# EAGLE design stokes_polarimeter (EAGLE 9.6.2)
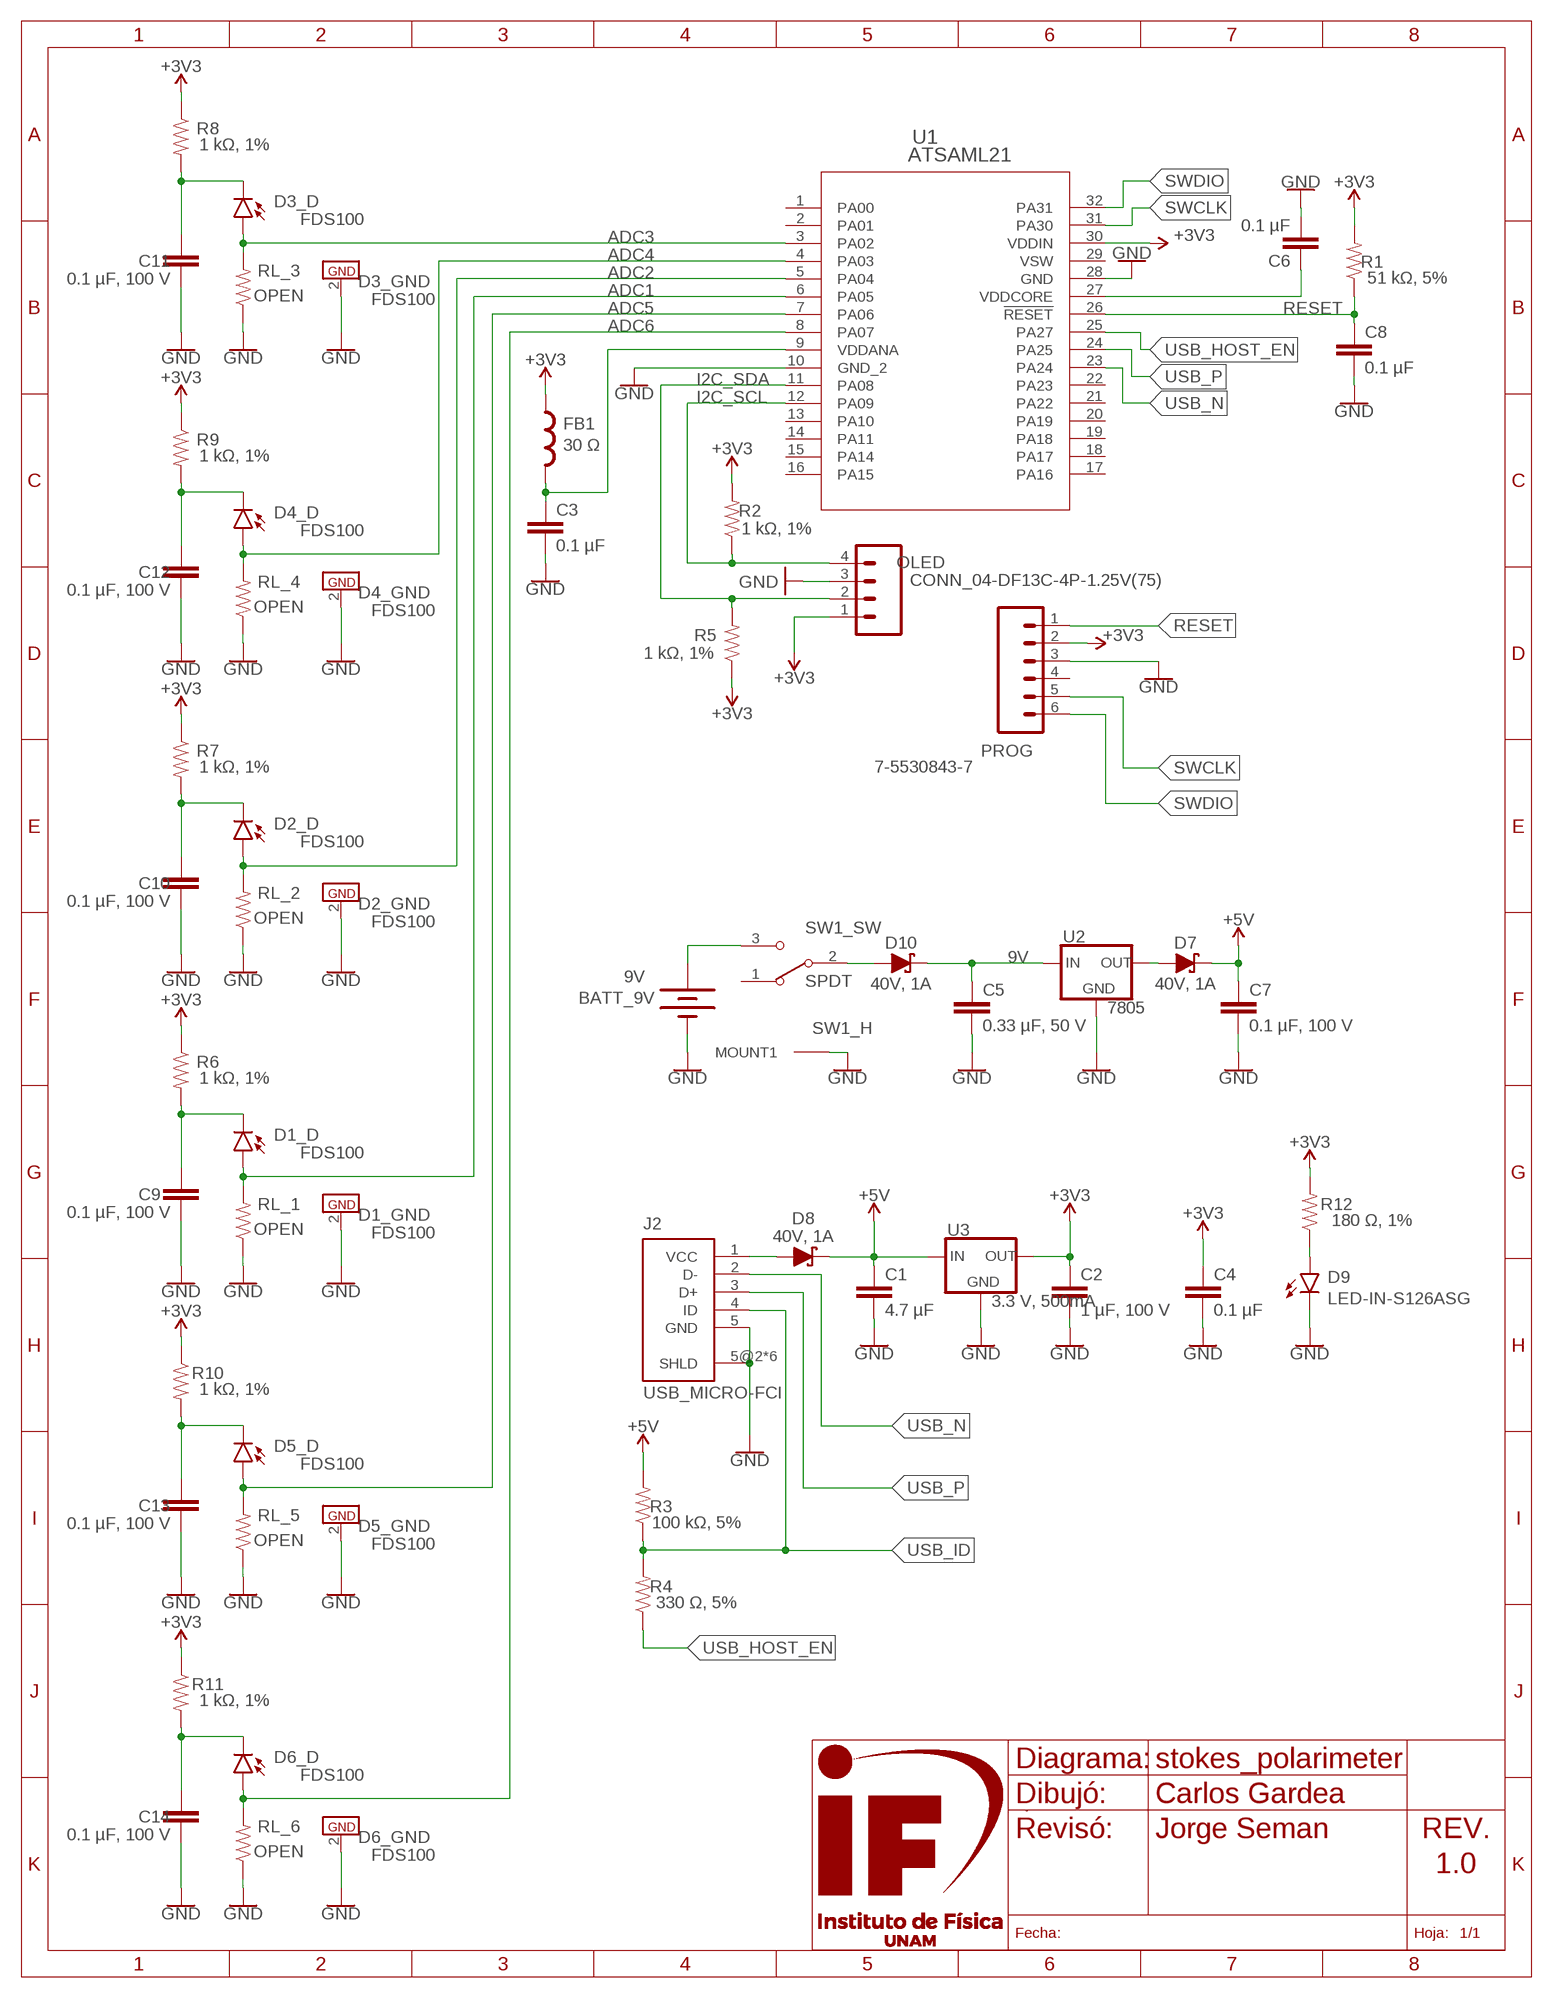
[diagram p0: schematic, sheet 1]

## Parts
BATT_9V  9V  9V_BATTERY-5331  [5331]
C1  4.7 µF  4.7µF-C1206C475K3PACTU  [C1206]
C2  1 µF, 100 V  1µF-C1206X105J1RACTU  [C1206]
C3  0.1 µF  0.1µF-C1206C104J1RACTU  [C1206]
C4  0.1 µF  0.1µF-C1206C104J1RACTU  [C1206]
C5  0.33 µF, 50 V  0.33µF-CL31B334KBFNNNE  [C1206]
C6  0.1 µF  0.1µF-C1206C104J1RACTU  [C1206]
C7  0.1 µF, 100 V  0.1µF-12061C104KAT2A  [C1206]
C8  0.1 µF  0.1µF-C1206C104J1RACTU  [C1206]
C9  0.1 µF, 100 V  0.1µF-12061C104KAT2A  [C1206]
C10  0.1 µF, 100 V  0.1µF-12061C104KAT2A  [C1206]
C11  0.1 µF, 100 V  0.1µF-12061C104KAT2A  [C1206]
C12  0.1 µF, 100 V  0.1µF-12061C104KAT2A  [C1206]
C13  0.1 µF, 100 V  0.1µF-12061C104KAT2A  [C1206]
C14  0.1 µF, 100 V  0.1µF-12061C104KAT2A  [C1206]
D1  FDS100  FDS100-VERT  [FDS100_VERT]
D2  FDS100  FDS100-VERT  [FDS100_VERT]
D3  FDS100  FDS100-VERT  [FDS100_VERT]
D4  FDS100  FDS100-VERT  [FDS100_VERT]
D5  FDS100  FDS100-VERT  [FDS100_VERT]
D6  FDS100  FDS100-VERT  [FDS100_VERT]
D7  40V, 1A  DIODE_SCHOTTKY-RB160L-40TE25  [DO-214AC]
D8  40V, 1A  DIODE_SCHOTTKY-RB160L-40TE25  [DO-214AC]
D9  LED-IN-S126ASG  [IN-S126AS]
D10  40V, 1A  DIODE_SCHOTTKY-RB160L-40TE25  [DO-214AC]
FB1  30 Ω  FERRITE-MFBM1V3216-300-R  [L1206]
J2  USB_MICRO-FCI  [10103594-0001LF_FCI]
OLED  CONN_04-DF13C-4P-1.25V(75)  [DF13C4P125V]
PROG  7-5530843-7  EDGE_06  [7-5530843-7]
R1  51 kΩ, 5%  51KΩ-RMCF1206JT51K0  [R1206]
R2  1 kΩ, 1%  1KΩ-RC1206FR-071KL  [R1206]
R3  100 kΩ, 5%  100KΩ-RC1206JR-07100KL  [R1206]
R4  330 Ω, 5%  330Ω-RC1206JR-13330RL  [R1206]
R5  1 kΩ, 1%  1KΩ-RC1206FR-071KL  [R1206]
R6  1 kΩ, 1%  1KΩ-RC1206FR-071KL  [R1206]
R7  1 kΩ, 1%  1KΩ-RC1206FR-071KL  [R1206]
R8  1 kΩ, 1%  1KΩ-RC1206FR-071KL  [R1206]
R9  1 kΩ, 1%  1KΩ-RC1206FR-071KL  [R1206]
R10  1 kΩ, 1%  1KΩ-RC1206FR-071KL  [R1206]
R11  1 kΩ, 1%  1KΩ-RC1206FR-071KL  [R1206]
R12  180 Ω, 1%  180Ω-RC1206FR-07180RL  [R1206]
RL_1  OPEN  OPEN-1206  [R1206_OPEN]
RL_2  OPEN  OPEN-1206  [R1206_OPEN]
RL_3  OPEN  OPEN-1206  [R1206_OPEN]
RL_4  OPEN  OPEN-1206  [R1206_OPEN]
RL_5  OPEN  OPEN-1206  [R1206_OPEN]
RL_6  OPEN  OPEN-1206  [R1206_OPEN]
SW1  SPDT  SK12F17G7-SK12F17G7  [SK12F17G7]
U1  ATSAML21  ATSAML21-ATSAML21E16B-ANT  [TQFP32]
U2  7805  MC7805CT-L7805CDT-TR  [DPAK]
U3  3.3 V, 500mA  MCP1825-MCP1825S-3302E/DB  [SOT223]
U$54  IFUNAM_FRAME_LETTER_VNONE  [NONE]

## Nets
9V: C5.1 D10.K(C) U2.1(IN)
+3V3: C2.1 C4.1 FB1.1 OLED.1 PROG.2 R1.2 R2.2 R5.1 R6.1 R7.1 R8.1 R9.1 R10.1 R11.1 R12.2 U1.30(VDDIN) U3.3(OUT)
+5V: C1.1 C7.1 D7.K(C) D8.K(C) R3.2 U3.1(IN)
ADC1: D1.1(_D:A) RL_1.2 U1.6(PA05)
ADC2: D2.1(_D:A) RL_2.2 U1.5(PA04)
ADC3: D3.1(_D:A) RL_3.2 U1.3(PA02)
ADC4: D4.1(_D:A) RL_4.2 U1.4(PA03)
ADC5: D5.1(_D:A) RL_5.2 U1.7(PA06)
ADC6: D6.1(_D:A) RL_6.2 U1.8(PA07)
GND: BATT_9V.- C1.2 C2.2 C3.2 C4.2 C5.2 C6.2 C7.2 C8.2 C9.2 C10.2 C11.2 C12.2 C13.2 C14.2 D1.2(_GND:P$GND) D2.2(_GND:P$GND) D3.2(_GND:P$GND) D4.2(_GND:P$GND) D5.2(_GND:P$GND) D6.2(_GND:P$GND) D9.K(C) J2.5(GND) J2.5@2(SHLD) J2.5@3(SHLD) J2.5@4(SHLD) J2.5@5(SHLD) J2.5@6(SHLD) J2.5@7(SHLD) OLED.3 PROG.3 RL_1.1 RL_2.1 RL_3.1 RL_4.1 RL_5.1 RL_6.1 SW1.MH1(_H:MOUNT1) SW1.MH2(_H:MOUNT1) SW1.MH3(_H:MOUNT1) SW1.MH4(_H:MOUNT1) U1.10(GND_2) U1.28(GND) U2.4(GND) U3.2(GND) U3.4(GND)
I2C_SCL: OLED.4 R2.1 U1.12(PA09)
I2C_SDA: OLED.2 R5.2 U1.11(PA08)
N$1: C10.1 D2.3(_D:C) R7.2
N$2: D10.A SW1.2(_SW:COMMON)
N$3: C9.1 D1.3(_D:C) R6.2
N$4: D9.A R12.1
N$5: C11.1 D3.3(_D:C) R8.2
N$6: BATT_9V.+ SW1.3(_SW:NO)
N$12: C12.1 D4.3(_D:C) R9.2
N$14: C13.1 D5.3(_D:C) R10.2
N$16: C14.1 D6.3(_D:C) R11.2
N$18: D7.A U2.3(OUT)
N$19: D8.A J2.1(VCC)
RESET: C8.1 PROG.1 R1.1 U1.26(!RESET)
SWCLK: PROG.5 U1.31(PA30)
SWDIO: PROG.6 U1.32(PA31)
USB_HOST_EN: R4.1 U1.25(PA27)
USB_ID: J2.4(ID) R3.1 R4.2
USB_N [gnd]: J2.2(D-) U1.23(PA24)
USB_P [gnd]: J2.3(D+) U1.24(PA25)
VDDANA: C3.1 FB1.2 U1.9(VDDANA)
VDDCORE: C6.1 U1.27(VDDCORE)
Unconnected: PROG.4 SW1.1(_SW:NC) U1.1(PA00) U1.2(PA01) U1.13(PA10) U1.14(PA11) U1.15(PA14) U1.16(PA15) U1.17(PA16) U1.18(PA17) U1.19(PA18) U1.20(PA19) U1.21(PA22) U1.22(PA23) U1.29(VSW)

## Library data of the parts
BATT_9V = IFUNAM-Connectors:9V_BATTERY: Cylindrical Battery Contacts, Clips, Holders & Springs; MFR: Keystone Electronics; MFR#: 5331; MOUSER#: 2x_534-5331
C1 = IFUNAM-Capacitors:4.7µF: 4.7 µF Capacitor; DIGIKEY#: 399-3142-2-ND; MFR: KEMET; MFR#: C1206C475K3PACTU; MOUSER#: 80-C1206C475K3P
C2 = IFUNAM-Capacitors:1µF: 1 µF Capacitor; MFR: KEMET; MFR#: C1206X105J1RACTU; MOUSER#: 80-C1206X105J1R
C3 C4 C6 C8 = IFUNAM-Capacitors:0.1µF: 0.1 µF Ceramic Capacitor; MFR: KEMET; MFR#: C1206C104J1RACTU; MOUSER#: 80-C1206C104J1R
C5 = IFUNAM-Capacitors:0.33µF: 0.33 µF Capacitor; MFR: Samsung Electro-Mechanics; MFR#: CL31B334KBFNNNE; MOUSER#: 187-CL31B334KBFNNNE
C7 C9-C14 = IFUNAM-Capacitors:0.1µF: 0.1 µF Ceramic Capacitor; MFR: AVX; MFR#: 12061C104KAT2A; MOUSER#: 581-12061C104K
D1-D6 = IFUNAM-DiscreteSemi:FDS100: Si Photodiode, 10 ns Rise Time, 350 - 1100 nm, 3.6 mm x 3.6 mm Active Area; MFR: THORLABS; MFR#: FDS100; MOGLABS#: FDS100
D7 D8 D10 = IFUNAM-DiscreteSemi:DIODE_SCHOTTKY: Schottky Diodes & Rectifiers Schottky; MFR: ROHM Semiconductor; MFR#: RB160L-40TE25; MOUSER#: 755-RB160L-40TE25
D9 = IFUNAM-DiscreteSemi:LED: LED Indication - Discrete Radial; MFR: Inolux; MFR#: IN-S126ASG; MOUSER#: 743-IN-S126ASG
FB1 = IFUNAM-Inductors:FERRITE: Ferrite Bead; MFR: Bussmann / Eaton; MFR#: MFBM1V3216-300-R; MOUSER#: 704-MFBM1V3216-300-R
J2 = IFUNAM-Connectors:USB_MICRO: USB - micro B USB 2.0 Receptacle Connector 5 Position Surface Mount, Right Angle; Through Hole; DIGIKEY#: 609-4050-1-ND; MFR: Amphenol ICC (FCI); MFR#: 10103594-0001LF; MOUSER#: 649-10103594-0001LF
OLED = IFUNAM-Connectors:CONN_04: 4 Position Connector; MFR: Hirose Connector; MFR#: DF13C-4P-1.25V(75); MOUSER#: 798-DF13C-4P-1.25V75
PROG = IFUNAM-Pulseoximeter:EDGE_06: Standard Card Edge Connectors CONN SEC II 3 POS 100C/L; MFR: TE Connectivity; MFR#: 7-5530843-7; MOUSER#: 571-7-5530843-7
R1 = IFUNAM-Resistors:51KΩ: Resistor, 51 kΩ; DIGIKEY#: RMCF1206JT51K0CT-ND; MFR: Stackpole Electronics Inc; MFR#: RMCF1206JT51K0
R2 R5-R11 = IFUNAM-Resistors:1KΩ: Resistor, 1 kΩ; DIGIKEY#: 311-1.00KFRCT-ND; MFR: Yageo; MFR#: RC1206FR-071KL; MOUSER#: 603-RC1206FR-071KL
R3 = IFUNAM-Resistors:100KΩ: 100 kΩ Resistor; MFR: YAGEO; MFR#: RC1206JR-07100KL; MOUSER#: 603-RC1206JR-07100KL
R4 = IFUNAM-Resistors:330Ω: 330 Ω Resistor; MFR: Yageo; MFR#: RC1206JR-13330RL; MOUSER#: 603-RC1206JR-13330RL
R12 = IFUNAM-Resistors:180Ω: 180 Ω Resistor; MFR: Yageo; MFR#: RC1206FR-07180RL; MOUSER#: 603-RC1206FR-07180RL
RL_1-RL_6 = IFUNAM-Resistors:OPEN: OPEN; MFR: NA; MFR#: NA; MOUSER#: NA
SW1 = IFUNAM-Switches:SK12F17G7: Slide Switches SPDT 0.3 Amp at 30 V; MFR: C&K; MFR#: SK12F17G7; MOUSER#: 611-SK-12F17-G7
U1 = IFUNAM-DiscreteSemi:ATSAML21: ARM Microcontrollers - MCU 32TQFP 85C, GREEN,1.6-3.6V,48MHz; MFR: Microchip Technology / Atmel; MFR#: ATSAML21E16B-ANT; MOUSER#: 579-ATSAML21E16B-ANT
U2 = IFUNAM-DiscreteSemi:MC7805CT: Linear Voltage Regulator IC Positive Fixed 1 Output 5V 1A; MFR: STMicroelectronics; MFR#: L7805CDT-TR; MOUSER#: 511-L7805CDT-TR
U3 = IFUNAM-DiscreteSemi:MCP1825: LDO Voltage Regulators 500 mA CMOS LDO; MFR: Microchip Technology; MFR#: MCP1825S-3302E/DB; MOUSER#: 579-MCP1825S-3302EDB
U$54 = IFUNAM-Art:IFUNAM_FRAME_LETTER_V: Frame LETTER; AUTHOR: Carlos Gardea; REV: 1.0; REVISOR: Jorge Seman

## Board
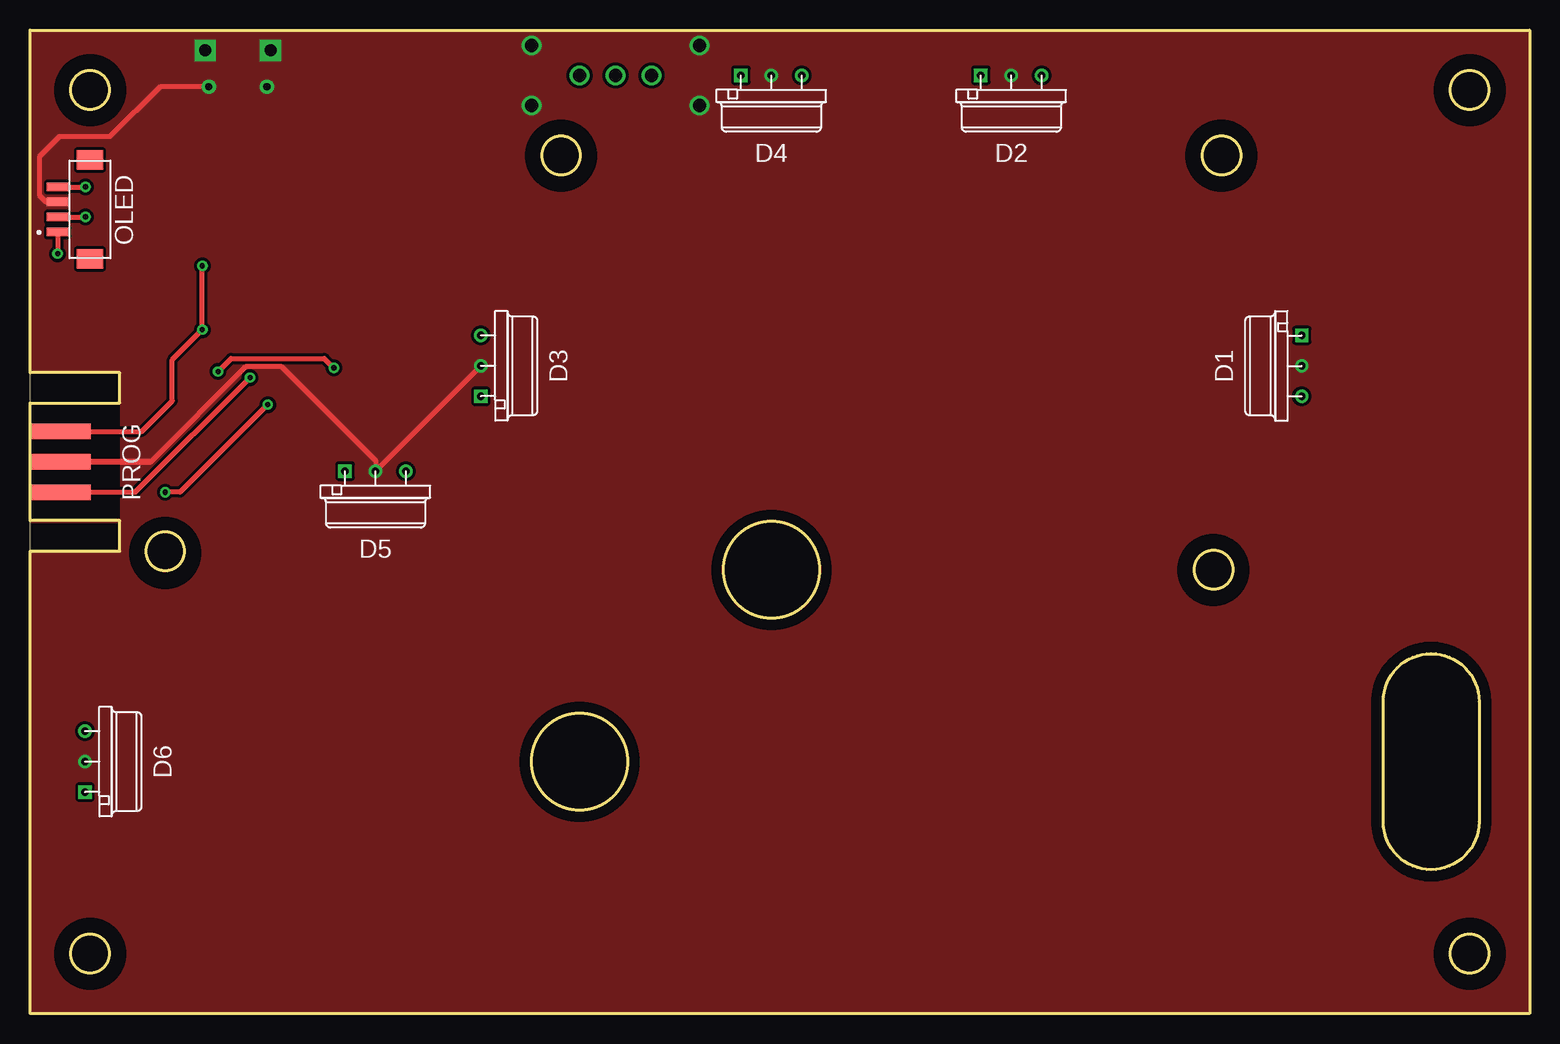
[diagram p1: board, top side]
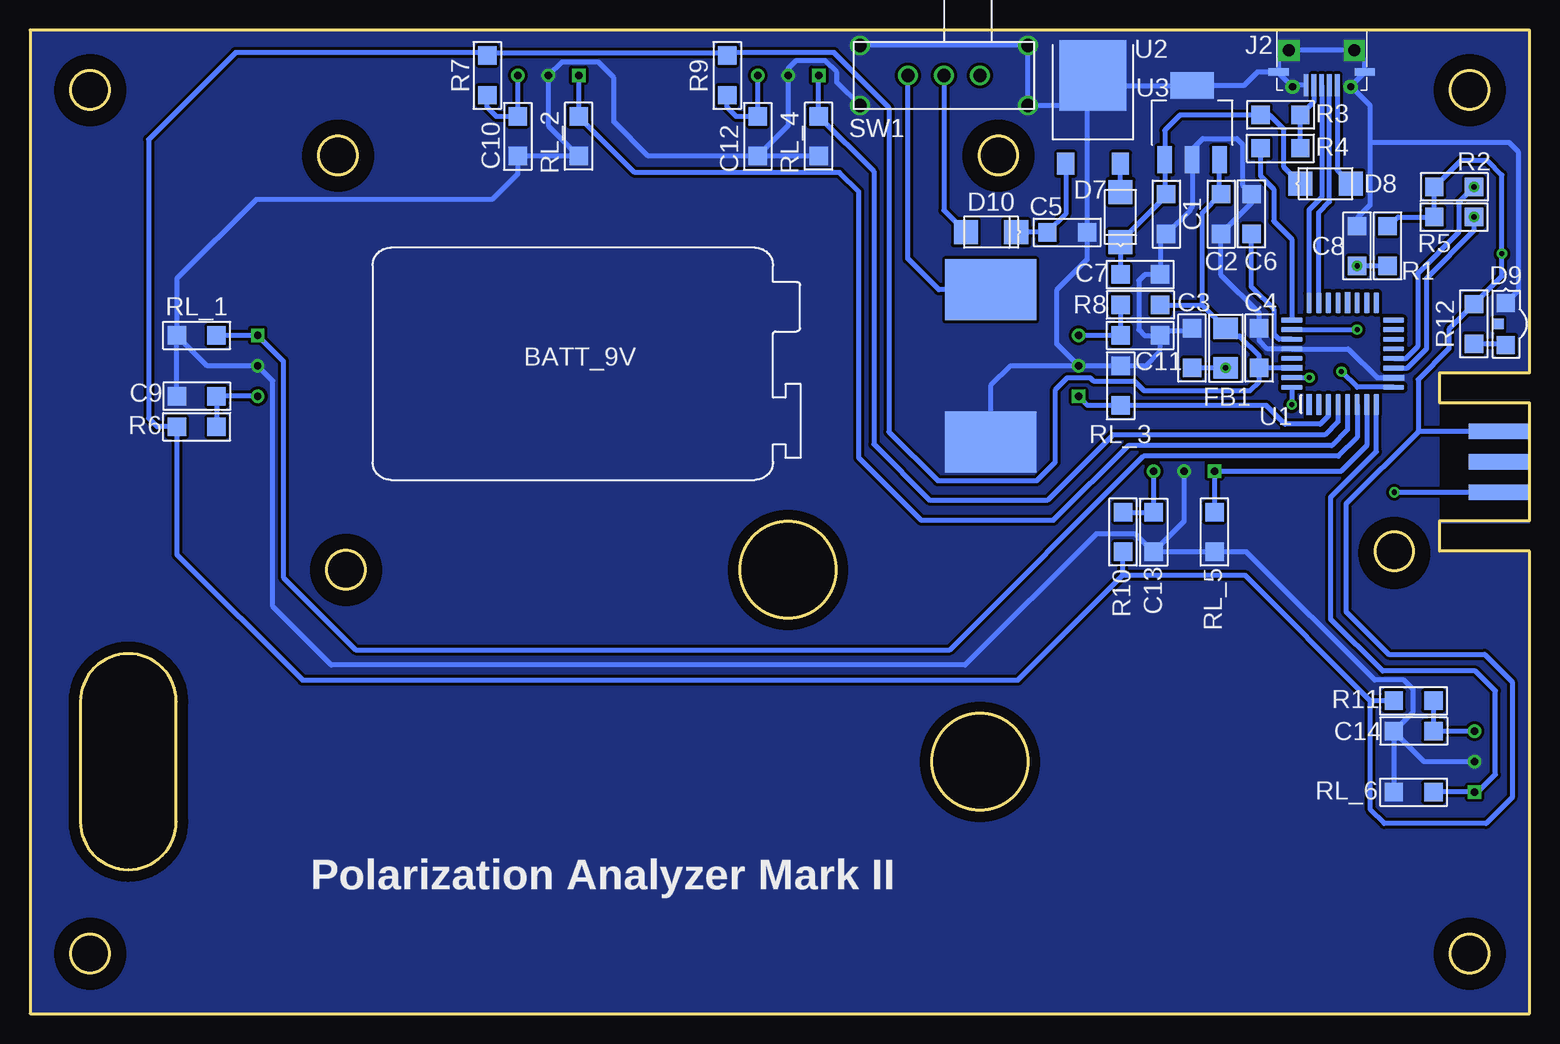
[diagram p2: board, bottom side, seen from below]

Size 125 x 82 mm. Coordinates in mm from the lower left corner, seen from the top.
Outline: 125,82 125,0 0,0 0,38.56 7.49,38.56 7.49,41.1 0,41.1 0,50.9 7.49,50.9 7.49,53.43 0,53.43 0,82 125,82
Outline: 112.8,16 112.8,26 arc-180 120.8,26 120.8,16 arc-180 112.8,16
Outline: circle at 120,5 radius 1.6
Outline: circle at 44.27,71.53 radius 1.6
Outline: circle at 11.27,38.53 radius 1.6
Outline: circle at 99.33,71.53 radius 1.6
Outline: circle at 98.65,37 radius 1.6
Outline: circle at 5,77 radius 1.6
Outline: circle at 5,5 radius 1.6
Outline: circle at 120,77 radius 1.6
Outline: circle at 61.8,37 radius 4
Outline: circle at 45.8,21 radius 4
Copper layers (1*16): Top 0.035mm / dielectric 1.5mm / Bottom 0.035mm
Design rules "default *": minimum track width 6mil, minimum drill 0.3mm, track to track 10mil, track to pad 10mil, pad to pad 10mil, via to via 10mil, smd to smd 0mil, copper to edge 0mil, drill to drill 6mil, minimum pad ring 10mil, minimum via ring 8mil, stop-mask expansion 4mil, vias tented up to drill 17mil, thermal gap 10mil
tRestrict: area 0,41.1 to 7.5,50.9; area 3.5,75.5 to 6.5,78.5; area 9.8,36.9 to 12.8,39.9; area 3.5,3.5 to 6.5,6.5; area 42.8,70 to 45.8,73; area 97.8,70 to 100.8,73; area 118.5,75.5 to 121.5,78.5; area 118.5,3.5 to 121.5,6.5; area 97.2,35.5 to 100.2,38.5; area 59.8,35 to 63.8,39; area 43.8,19 to 47.8,23; 4 lines
bRestrict: area 0,41.1 to 7.5,50.9; area 3.5,75.5 to 6.5,78.5; area 9.8,36.9 to 12.8,39.9; area 3.5,3.5 to 6.5,6.5; area 42.8,70 to 45.8,73; area 97.8,70 to 100.8,73; area 118.5,75.5 to 121.5,78.5; area 118.5,3.5 to 121.5,6.5; area 97.2,35.5 to 100.2,38.5; area 59.8,35 to 63.8,39; area 43.8,19 to 47.8,23; 4 lines

### Footprints (pad centres in the part's own frame; a part is rotated, then mirrored left to right if it is on the bottom)
5331 = smd 7.62 x 5.08: + 57.081,6.35; - 57.081,-6.35
C1206 = smd 1.524 x 1.524: 1 -1.651,0; 2 1.651,0
FDS100_VERT = drill 0.61 square: 1 2.54,0 | drill 0.61: 2 0,0; 3 -2.54,0
DO-214AC = smd 2.007 x 2.007: A 2.095,0; K -2.095,0
IN-S126AS = smd 1.5 x 1.5: A 1.75,0; K -1.75,0 | smd 0.9 x 0.9: H 0,-0.65
L1206 = smd 1.778 x 2.032: 1 -1.651,0; 2 1.651,0
10103594-0001LF_FCI = smd 0.4 x 1.8: 1 -1.3,4.6; 2 -0.65,4.6; 3 0,4.6; 4 0.65,4.6; 5 1.3,4.6 | drill 0.6 pad 1.2: 5@2 -2.425,4.73; 5@3 2.425,4.73 | drill 1 pad 1.778 square: 5@4 -2.725,1.7; 5@5 2.725,1.7 | smd 1.7 x 0.635: 5@6 -3.6,3.5; 5@7 3.6,3.5
DF13C4P125V = smd 0.7 x 1.8: 1 -1.875,2.7; 2 -0.625,2.7; 3 0.625,2.7; 4 1.875,2.7 | smd 1.6 x 2.2: MP1 -4.125,0; MP2 4.125,0
7-5530843-7 = smd 1.27 x 5.08: 1 -2.54,2.54; 3 0,2.54; 5 2.54,2.54 | smd 1.27 x 5.08 bottom: 2 -2.54,2.54; 4 0,2.54; 6 2.54,2.54
R1206 = smd 1.524 x 1.524: 1 -1.651,0; 2 1.651,0
R1206_OPEN = smd 1.524 x 1.524: 1 -1.651,0; 2 1.651,0
SK12F17G7 = drill 1.1 pad 1.65: 1 -3,0; 2 0,0; 3 3,0; MH1 -7,2.5; MH2 -7,-2.5; MH3 7,-2.5; MH4 7,2.5
TQFP32 = smd 0.457 x 1.778: 1 -2.8,-4.248; 2 -2,-4.248; 3 -1.2,-4.248; 4 -0.4,-4.248; 5 0.4,-4.248; 6 1.2,-4.248; 7 2,-4.248; 8 2.8,-4.248; 17 2.8,4.248; 18 2,4.248; 19 1.2,4.248; 20 0.4,4.248; 21 -0.4,4.248; 22 -1.2,4.248; 23 -2,4.248; 24 -2.8,4.248 | smd 1.778 x 0.457: 9 4.248,-2.8; 10 4.248,-2; 11 4.248,-1.2; 12 4.248,-0.4; 13 4.248,0.4; 14 4.248,1.2; 15 4.248,2; 16 4.248,2.8; 25 -4.248,2.8; 26 -4.248,2; 27 -4.248,1.2; 28 -4.248,0.4; 29 -4.248,-0.4; 30 -4.248,-1.2; 31 -4.248,-2; 32 -4.248,-2.8
DPAK = smd 1.422 x 1.829: 1 -2.286,-3.683; 3 2.286,-3.683 | smd 5.588 x 5.842: 4 0,3.683
SOT223 = smd 1.219 x 2.235: 1 -2.286,-3.099; 2 0,-3.099; 3 2.286,-3.099 | smd 3.607 x 2.235: 4 0,3.099

### Placement (x,y rotation side)
BATT_9V  102,54 0 bottom
C1  30.28,66.65 270 bottom
C2  25.71,66.65 270 bottom
C3  28.12,55.48 90 bottom
C4  22.53,55.48 90 bottom
C5  38.54,65.13 0 bottom
C6  23.17,66.65 90 bottom
C7  32.44,61.62 0 bottom
C8  14.37,63.99 90 bottom
C9  111.1,51.46 180 bottom
C10  84.34,73.14 270 bottom
C11  32.44,56.54 0 bottom
C12  64.34,73.14 270 bottom
C13  31.34,40.14 270 bottom
C14  9.66,23.54 180 bottom
D1  106.02,54 90 top
D2  81.8,78.22 180 top
D3  37.58,54 270 top
D4  61.8,78.22 180 top
D5  28.8,45.22 180 top
D6  4.58,21 270 top
D7  34.09,66.4 90 bottom
D8  17,69.19 0 bottom
D9  1.96,57.49 270 bottom
D10  44.89,65.13 180 bottom
FB1  25.33,55.48 270 bottom
J2  17.33,82 180 bottom
OLED  5,67.03 90 top
PROG  0,46 270 top
R1  11.83,63.99 90 bottom
R2  6.28,68.91 180 bottom
R3  20.76,74.91 180 bottom
R4  20.76,72.14 0 bottom
R5  6.28,66.41 0 bottom
R6  111.1,48.92 0 bottom
R7  86.88,78.22 270 bottom
R8  32.44,59.08 180 bottom
R9  66.88,78.22 270 bottom
R10  33.88,40.14 90 bottom
R11  9.66,26.08 0 bottom
R12  4.63,57.49 90 bottom
RL_1  111.1,56.54 0 bottom
RL_2  79.26,73.14 90 bottom
RL_3  34.09,52.35 270 bottom
RL_4  59.26,73.14 90 bottom
RL_5  26.26,40.14 90 bottom
RL_6  9.66,18.46 0 bottom
SW1  48.82,78.21 180 bottom
U1  15.57,55.02 0 bottom
U2  36.38,74.53 0 bottom
U3  28.12,74.27 0 bottom
U$54  60,41 0 top

### Tracks (layer width: path | path; a pad name or v marks a point on that pad's centre or on a via)
9V
  Bottom 0.406: U2.1 38.66,66.65 C5.1 D10.K
+3V3  (via drill 0.43 pad 0.86)
  Top 0.406: OLED.1 v2.3,63.35
  Bottom 0.406: U3.3 25.84,67.8 25.33,68.31 C2.1 27.28,66.73 27.28,59.08 | 86.92,80.11 107.87,80.11 115.12,72.86 115.12,49.64 114.4,48.92 R6.1 112.75,38.25 102.29,27.79 42.64,27.79 33.88,36.55 | 86.92,80.11 67.12,80.11 R9.1 66.64,80.11 57.97,80.11 53.4,75.54 53.4,48.49 49.33,44.43 41.08,44.43 39.55,45.95 39.55,51.98 38.55,52.98 36.62,52.98 36.36,52.73 32.95,52.73 32.14,51.92 23.3,51.92 22.53,52.68 C4.1 | R7.1 86.92,79.91 86.92,80.11 | 13.26,26.08 13.26,17 12.12,15.85 3.61,15.85 1.45,18.01 1.45,27.66 3.74,29.95 11.74,29.95 15.3,33.51 15.3,42.49 9.25,48.54 | R11.1 13.26,26.08 | 27.28,59.08 FB1.1 24.69,56.49 24.19,56.49 22.53,54.84 C4.1 | R8.1 27.28,59.08 | U1.30 22.52,53.82 C4.1 | 33.88,36.55 23.74,36.55 13.26,26.08 | 33.88,36.55 R10.1 | PROG.2 9.25,48.54 | 9.25,48.54 9.27,48.54 9.27,52.86 6.72,55.42 6.72,57.06 R12.2 2.3,61.47 v2.3,63.35 2.3,69.91 3.48,71.1 5.74,71.1 R2.2 R5.1 10.97,66.41 R1.2
+5V
  Bottom 0.406: C7.1 D7.K 34.09,64.37 30.28,68.18 C1.1 30.41,68.43 U3.1 30.41,73.64 29.14,74.91 R3.2 21.65,74.91 20.48,73.74 20.48,70.57 D8.K
ADC1
  Bottom 0.406: RL_1.2 D1.1 103.88,54.4 103.88,36.36 97.85,30.33 48.32,30.33 32.19,46.46 15.93,46.46 14.37,48.02 U1.6
ADC2
  Bottom 0.406: D2.1 RL_2.2 74.59,70.12 57.5,70.12 55.94,68.55 55.94,46.35 50.71,41.13 39.68,41.13 33.46,47.35 16.49,47.35 15.17,48.67 U1.5
ADC3
  Bottom 0.406: U1.3 16.77,49.82 17.45,49.13 20.38,49.13 21.95,50.7 RL_3.2 36.82,50.7 D3.1
ADC4
  Bottom 0.406: U1.4 15.97,49.35 17.07,48.24 34.73,48.24 40.19,42.78 49.97,42.78 54.67,47.48 54.67,70.22 59.24,74.79 RL_4.2 D4.1
ADC5
  Bottom 0.406: RL_5.2 D5.1 15.7,45.22 13.57,47.35 U1.7
ADC6
  Bottom 0.406: RL_6.2 D6.1 4.31,18.46 2.85,19.92 2.85,26.9 4.5,28.55 12.25,28.55 16.57,32.87 16.57,43.04 12.77,46.84 U1.8
GND
  Top 0.406: D3.2 D5.2 28.8,46.11 20.98,53.93 17.99,53.93 10.06,46 | J2.5@2 10.84,77.27 6.7,73.13 2.47,73.13 0.82,71.48 0.82,68.18 1.34,67.66 OLED.3
  Top 0.508: 10.06,46 PROG.3
  Bottom 0.406: U2.4 35.54,77.37 U3.4 23.83,77.37 22.71,78.5 J2.5@7 | J2.5@7 20.93,78.44 J2.5@3 19.62,77.4 J2.5 | J2.5@7 20.93,79.42 J2.5@5 J2.5@4 13.73,79.42 J2.5@6 14.9,77.33 | 14.9,77.33 J2.5@2 | D3.2 43.27,54 44.92,52.35 BATT_9V.- | RL_4.1 C12.2 | C12.2 61.8,74.03 D4.2 61.8,78.79 61.14,79.45 58.72,79.45 57.74,78.46 57.74,77.62 SW1.MH4 | D5.2 28.8,41.03 C13.2 | C13.2 RL_5.1 23.59,38.49 12.9,27.79 10.47,27.79 9.71,27.03 9.71,25.14 C14.2 | RL_1.1 110.21,54 D1.2 104.77,52.75 104.77,33.95 99.88,29.06 47.05,29.06 36.12,39.98 32.84,39.98 C13.2 | C9.2 RL_1.1 | C11.2 32.11,56.54 32.57,57 32.57,61.11 32.06,61.62 C7.2 30.79,64.5 C1.2 28.25,67.03 28.25,67.16 28.12,67.29 U3.2 28.12,72.06 27.23,72.95 24.4,72.95 24.34,72.9 23.93,72.5 23.93,69.07 C6.2 23.17,67.54 C2.2 25.71,61.57 22.53,58.4 C4.2 22.53,56.11 21.84,55.42 U1.28 15.11,55.42 12.71,53.02 U1.10 | C12.2 73.46,71.48 76.32,74.34 76.32,78.02 77.65,79.35 80.66,79.35 D2.2 81.8,74.03 RL_2.1 C10.2 84.34,70 86.48,67.86 106.16,67.86 112.75,61.27 RL_1.1 | C8.2 14.28,66.43 13.28,67.43 13.28,72.62 | 13.28,72.62 13.28,75.7 14.9,77.33 | D3.2 RL_3.1 31.99,54 30.85,55.14 C11.2 | C14.2 RL_6.1 | D6.2 8.77,21 C14.2 | C11.2 30.47,56.92 28.33,56.92 C3.2 | U2.4 36.89,77.7 C5.2 36.89,62.84 39.43,60.3 39.43,55.84 D3.2 | SW1.MH3 SW1.MH2 SW1.MH1 38.88,75.71 U2.4 | D9.K 0.95,60.26 0.95,71.86 1.71,72.62 13.28,72.62
  pour Bottom (no thermals): 125,0 0,0 0,38.56 7.49,38.56 7.49,41 0,41 0,50.9 7.49,50.9 7.49,53.43 0,53.43 0,82 125,82
  pour Top (no thermals): 125,0 0,0 0,38.56 7.49,38.56 7.49,41 0,41 0,50.9 7.49,50.9 7.49,53.43 0,53.43 0,82 125,82
I2C_SCL  (via drill 0.43 pad 0.86)
  Top 0.406: OLED.4 R2.1
  Bottom 0.406: U1.12 10.3,54.62 9.33,55.59 9.33,61.7 5.9,65.13 5.9,67.64 R2.1
  other vias: 4.63,68.91
I2C_SDA  (via drill 0.43 pad 0.86)
  Top 0.406: OLED.2 R5.2
  Bottom 0.406: U1.11 10.17,53.82 8.56,55.42 8.56,61.33 4.63,65.27 R5.2
  other vias: 4.63,66.41
N$1
  Bottom 0.406: D2.3 C10.1 86.12,74.79 86.88,75.55 R7.2
N$2
  Bottom 0.406: D10.A 48.82,66.97 SW1.2
N$3
  Bottom 0.406: D1.3 C9.1 R6.2
N$4
  Bottom 0.406: D9.A 2.06,55.84 R12.1
N$5
  Bottom 0.406: D3.3 C11.1 R8.2
N$6
  Bottom 0.406: BATT_9V.+ 49.24,60.35 51.82,62.94 SW1.3
N$12
  Bottom 0.406: D4.3 C12.1 66.12,74.79 66.88,75.55 R9.2
N$14
  Bottom 0.406: D5.3 C13.1 R10.2
N$16
  Bottom 0.406: D6.3 7.93,23.54 | 7.93,23.54 C14.1 | R11.2 8.01,23.62 7.93,23.54
N$18
  Bottom 0.406: D7.A U2.3
N$19
  Bottom 0.406: J2.1 16.03,70.31 D8.A
RESET  (via drill 0.43 pad 0.86)
  Top 0.406: PROG.1 9.33,48.54 11.87,51.08 11.87,54.52 v14.37,57.02 C8.1
  Bottom 0.406: C8.1 R1.1 | U1.26 v14.37,57.02
  other vias: 14.37,62.34
SWCLK  (via drill 0.43 pad 0.86)
  Top 0.406: v18.34,53.02 8.79,43.46 PROG.5
  Bottom 0.406: U1.31 v18.34,53.02
SWDIO  (via drill 0.43 pad 0.86)
  Top 0.406: v19.81,50.77 12.51,43.46 v11.27,43.46
  Bottom 0.406: U1.32 v19.81,50.77 | v11.27,43.46 PROG.6
USB_HOST_EN
  Bottom 0.406: R4.1 22.41,69.83 21.33,68.75 21.33,66.08 19.81,64.57 U1.25
USB_ID
  Bottom 0.406: R4.2 R3.1 17.98,76.04 J2.4
USB_N
  Bottom 0.406: J2.2 16.68,67.67 17.57,66.78 U1.23
USB_P
  Bottom 0.406: J2.3 17.33,68.05 18.37,67.01 U1.24
VDDANA  (via drill 0.43 pad 0.86)
  Top 0.406: v15.68,53.52 16.77,54.62 24.54,54.62 FB1.2
  Bottom 0.406: FB1.2 C3.1 | v15.68,53.52 14.37,52.22 U1.9
  other vias: 25.33,53.83
VDDCORE
  Bottom 0.406: U1.27 20.88,56.22 21.29,56.62 21.29,58.68 23.17,60.56 C6.1

### Text on the board
bPlace: Polarization Analyzer Mark II